# EAGLE schematic BigMuff2 (EAGLE 7.1.0)
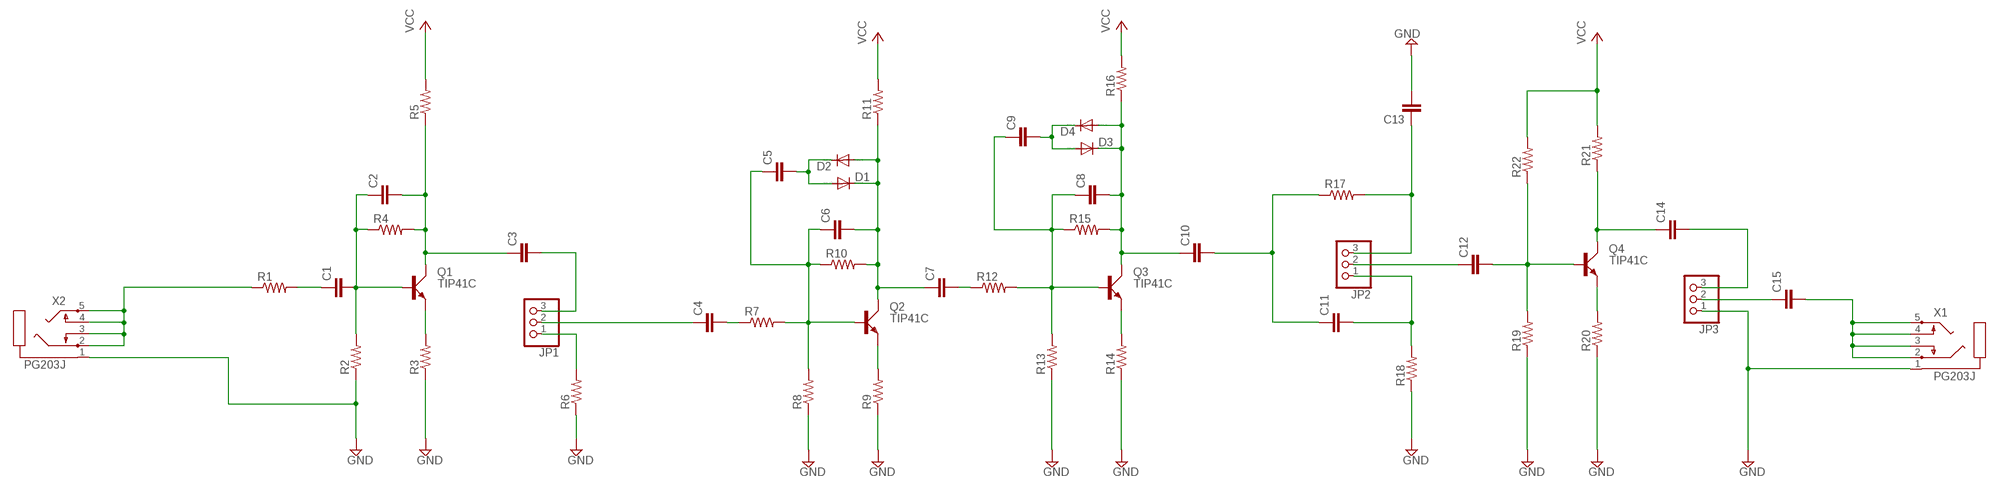
[diagram p0: schematic, sheet 1]

## Parts
C1  C2,5-3  [C2.5-3]
C2  C2,5-3  [C2.5-3]
C3  C2,5-3  [C2.5-3]
C4  C2,5-3  [C2.5-3]
C5  C2,5-3  [C2.5-3]
C6  C2,5-3  [C2.5-3]
C7  C2,5-3  [C2.5-3]
C8  C2,5-3  [C2.5-3]
C9  C2,5-3  [C2.5-3]
C10  C2,5-3  [C2.5-3]
C11  C2,5-3  [C2.5-3]
C12  C2,5-3  [C2.5-3]
C13  C2,5-3  [C2.5-3]
C14  C2,5-3  [C2.5-3]
C15  C2,5-3  [C2.5-3]
D1  DIODE-D-2.5  [D-2.5]
D2  DIODE-D-2.5  [D-2.5]
D3  DIODE-D-2.5  [D-2.5]
D4  DIODE-D-2.5  [D-2.5]
JP1  PINHD-1X3  [1X03]
JP2  PINHD-1X3  [1X03]
JP3  PINHD-1X3  [1X03]
Q1  TIP41C  [TO220AV]
Q2  TIP41C  [TO220AV]
Q3  TIP41C  [TO220AV]
Q4  TIP41C  [TO220AV]
R1  R-US_0204/2V  [0204V]
R2  R-US_0204/2V  [0204V]
R3  R-US_0204/2V  [0204V]
R4  R-US_0204/2V  [0204V]
R5  R-US_0204/2V  [0204V]
R6  R-US_0204/2V  [0204V]
R7  R-US_0204/2V  [0204V]
R8  R-US_0204/2V  [0204V]
R9  R-US_0204/2V  [0204V]
R10  R-US_0204/2V  [0204V]
R11  R-US_0204/2V  [0204V]
R12  R-US_0204/2V  [0204V]
R13  R-US_0204/2V  [0204V]
R14  R-US_0204/2V  [0204V]
R15  R-US_0204/2V  [0204V]
R16  R-US_0204/2V  [0204V]
R17  R-US_0204/2V  [0204V]
R18  R-US_0204/2V  [0204V]
R19  R-US_0204/2V  [0204V]
R20  R-US_0204/2V  [0204V]
R21  R-US_0204/2V  [0204V]
R22  R-US_0204/2V  [0204V]
X1  PG203J  [PG203J]
X2  PG203J  [PG203J]

## Nets
GND: C13.2 JP3.1 R2.1 R3.1 R6.1 R8.1 R9.1 R13.1 R14.1 R18.1 R19.1 R20.1 X1.1 X2.1
N$1: C2.2 C3.1 Q1.C R4.2 R5.1
N$2: C1.2 C2.1 Q1.B R2.2 R4.1
N$3: C1.1 R1.2
N$5: Q1.E R3.2
N$6: C3.2 JP1.3
N$7: JP1.1 R6.2
N$8: C14.1 Q4.C R21.1
N$9: C4.1 JP1.2
N$10: C6.2 C7.1 D1.C D2.A Q2.C R10.2 R11.1
N$11: C5.2 D1.A D2.C
N$12: C5.1 C6.1 Q2.B R7.2 R8.2 R10.1
N$13: Q2.E R9.2
N$14: C7.2 R12.1
N$15: C4.2 R7.1
N$16: C15.2 X1.2 X1.3 X1.4 X1.5
N$17: C8.2 C10.1 D3.C D4.A Q3.C R15.2 R16.1
N$18: C8.1 C9.1 Q3.B R12.2 R13.2 R15.1
N$19: Q3.E R14.2
N$20: C9.2 D3.A D4.C
N$21: C13.1 JP2.3 R17.2
N$23: C10.2 C11.1 R17.1
N$24: C12.1 JP2.2
N$26: C12.2 Q4.B R19.2 R22.1
N$27: C11.2 JP2.1 R18.2
N$28: Q4.E R20.2
N$29: C14.2 JP3.3
N$31: R1.1 X2.2 X2.3 X2.4 X2.5
N$32: C15.1 JP3.2
VCC: R5.2 R11.2 R16.2 R21.2 R22.2

## Library data of the parts
C1-C15 = capacitor-wima:C: CAPACITOR naming: grid - package width
D1-D4 = diode:DIODE-: DIODE
JP1-JP3 = pinhead:PINHD-1X3: PIN HEADER
Q1-Q4 = transistor-power:TIP41C: NPN TRANSISTOR
R1-R22 = resistor:R-US_: RESISTOR, American symbol
X1 X2 = con-hirschmann:PG203J: MIC/HEADPHONE JACK KS-S stereo microphone/headphone jack PG203JN (Schukat); OC_FARNELL: unknown; OC_NEWARK: unknown